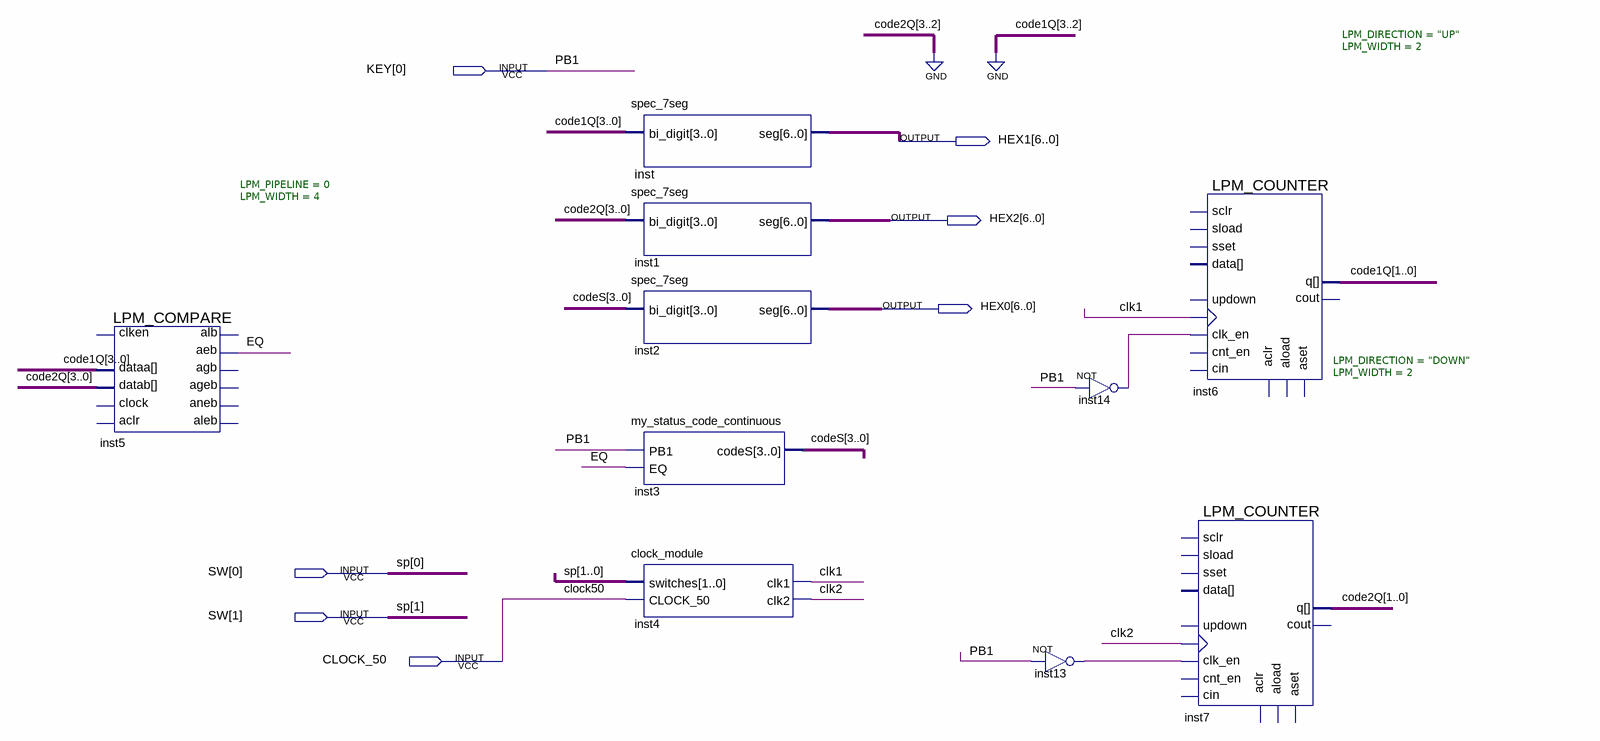
[diagram p0: schematic sheet]
// Quartus schematic Lab7.bdf as structural Verilog: 10 symbols, 7 pins
module Lab7 (
  input  [0:0] KEY,
  input  [1:0] SW,
  input  CLOCK_50,
  output [6:0] HEX1,
  output [6:0] HEX2,
  output [6:0] HEX0
);

  wire clk1, clk2, EQ, inst13_out, inst14_out;
  wire [1:0] code1Q, code2Q;
  wire [3:0] codeS;

  LPM_COMPARE #(.LPM_PIPELINE(0), .LPM_WIDTH(4)) inst5 (
    .dataa({2'b00, code1Q}), .datab({2'b00, code2Q}), .aeb(EQ));  // open: clock, aclr, clken, aleb, agb, aneb, ageb, alb
  spec_7seg inst (.bi_digit({2'b00, code1Q}), .seg(HEX1));
  spec_7seg inst1 (.bi_digit({2'b00, code2Q}), .seg(HEX2));
  spec_7seg inst2 (.bi_digit(codeS), .seg(HEX0));
  my_status_code_continuous inst3 (.PB1(KEY[0]), .EQ(EQ), .codeS(codeS));
  clock_module inst4 (.switches(SW), .CLOCK_50(CLOCK_50), .clk1(clk1), .clk2(clk2));
  not inst13 (inst13_out, KEY[0]);
  not inst14 (inst14_out, KEY[0]);
  LPM_COUNTER #(.LPM_DIRECTION("UP"), .LPM_WIDTH(2)) inst6 (
    .clock(clk1), .clk_en(inst14_out), .q(code1Q));  // open: sload, data, aload, aclr, aset, cin, sset, updown, cnt_en, sclr, cout
  LPM_COUNTER #(.LPM_DIRECTION("DOWN"), .LPM_WIDTH(2)) inst7 (
    .clock(clk2), .clk_en(inst13_out), .q(code2Q));  // open: sload, data, aload, aclr, aset, cin, sset, updown, cnt_en, sclr, cout

  // Other names for the same wires on the sheet: clock50 = CLOCK_50; PB1 = KEY[0]; sp[1:0] = SW
endmodule
